# Altium schematic sheet USB3.SchDoc (part 1 of 2)
size A3; Organization: ICNS, MARCS Institute; Address1: Werrington South Campus, Great Western Highway; Address2: Werrington, NSW, 2747; SheetNumber: 9; SheetTotal: 16
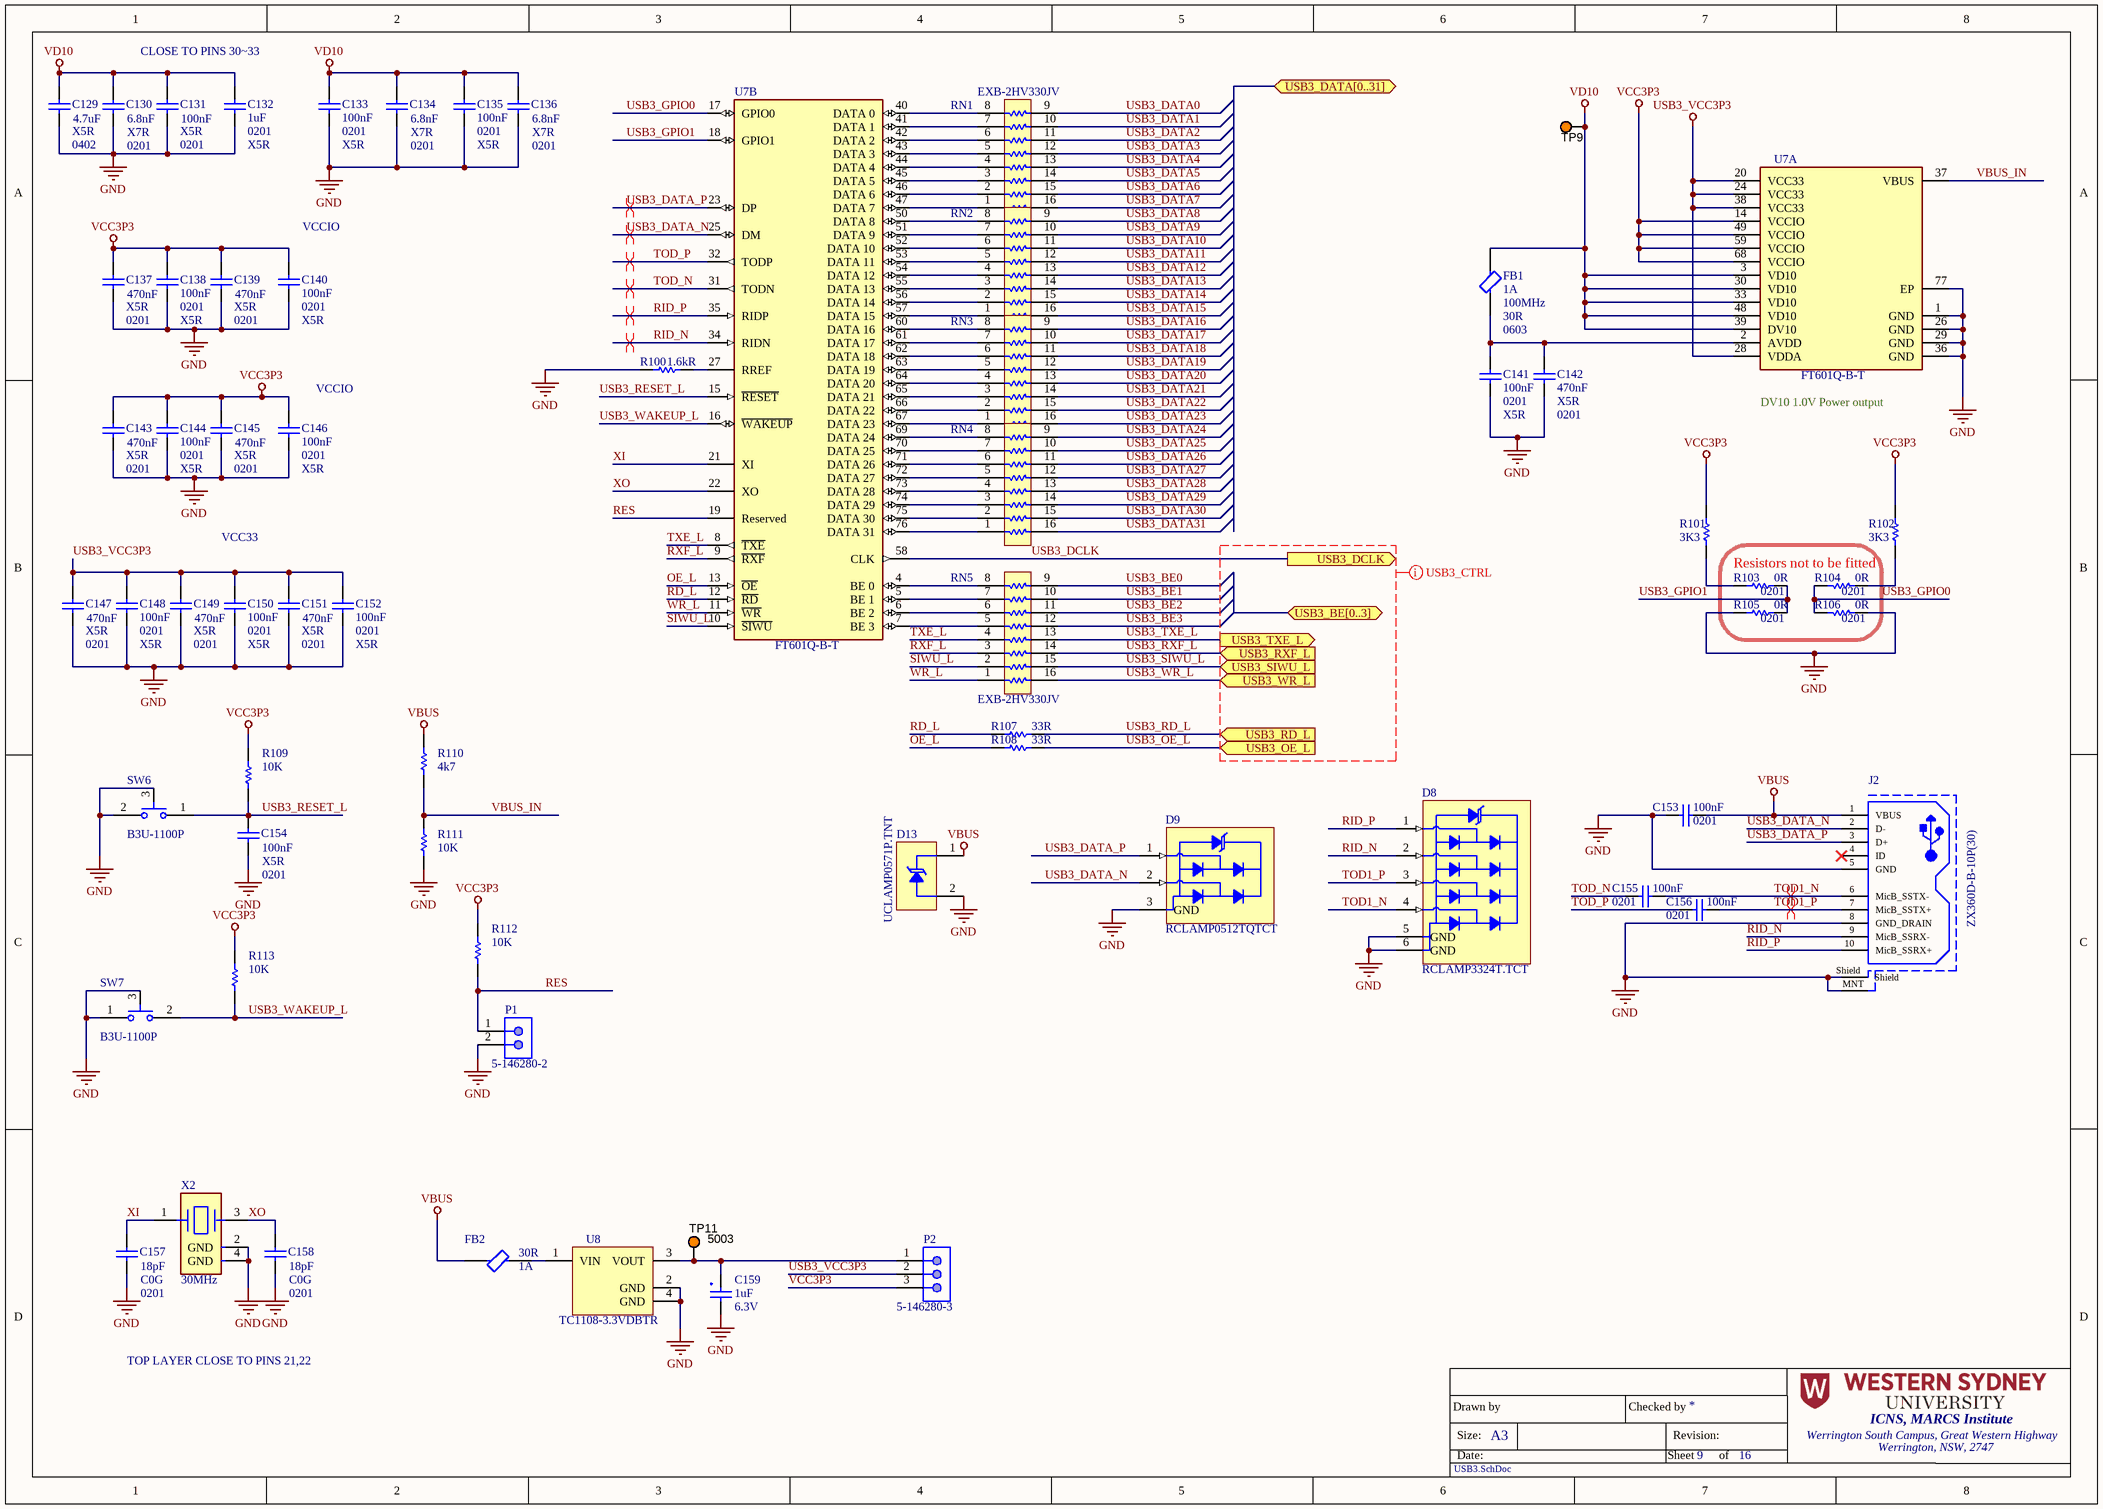
[diagram p0: USB3.SchDoc]

## Parts
C129  Capacitance: 4.7uF  Dielectric: X5R  Case Code (Imperial): 0402  [CAP 0402 (1005)]  (hidden comment: C1005X5R1A475K050BC)
C130  Dielectric: X7R  Capacitance: 6.8nF  Case Code (Imperial): 0201  [CAP 0201 (0603)]  (hidden comment: GRM033R71A682KA01D)
C131  Capacitance: 100nF  Dielectric: X5R  Case Code (Imperial): 0201  [CAP 0201 (0603)]  (hidden comment: CL03A104KP3NNNC)
C132  Capacitance: 1uF  Case Code (Imperial): 0201  Dielectric: X5R  [CAP 0201 (0603)]  (hidden comment: CL03A105KP3NSNC)
C133  Capacitance: 100nF  Case Code (Imperial): 0201  Dielectric: X5R  [CAP 0201 (0603)]  (hidden comment: CL03A104KP3NNNC)
C134  Dielectric: X7R  Capacitance: 6.8nF  Case Code (Imperial): 0201  [CAP 0201 (0603)]  (hidden comment: GRM033R71A682KA01D)
C135  Capacitance: 100nF  Case Code (Imperial): 0201  Dielectric: X5R  [CAP 0201 (0603)]  (hidden comment: CL03A104KP3NNNC)
C136  Dielectric: X7R  Capacitance: 6.8nF  Case Code (Imperial): 0201  [CAP 0201 (0603)]  (hidden comment: GRM033R71A682KA01D)
C137  Capacitance: 470nF  Dielectric: X5R  Case Code (Imperial): 0201  [CAP 0201 (0603)]  (hidden comment: LMK063BBJ474KPLF)
C138  Capacitance: 100nF  Case Code (Imperial): 0201  Dielectric: X5R  [CAP 0201 (0603)]  (hidden comment: CL03A104KP3NNNC)
C139  Capacitance: 470nF  Dielectric: X5R  Case Code (Imperial): 0201  [CAP 0201 (0603)]  (hidden comment: LMK063BBJ474KPLF)
C140  Capacitance: 100nF  Case Code (Imperial): 0201  Dielectric: X5R  [CAP 0201 (0603)]  (hidden comment: CL03A104KP3NNNC)
C141  Capacitance: 100nF  Case Code (Imperial): 0201  Dielectric: X5R  [CAP 0201 (0603)]  (hidden comment: CL03A104KP3NNNC)
C142  Capacitance: 470nF  Dielectric: X5R  Case Code (Imperial): 0201  [CAP 0201 (0603)]  (hidden comment: LMK063BBJ474KPLF)
C143  Capacitance: 470nF  Dielectric: X5R  Case Code (Imperial): 0201  [CAP 0201 (0603)]  (hidden comment: LMK063BBJ474KPLF)
C144  Capacitance: 100nF  Case Code (Imperial): 0201  Dielectric: X5R  [CAP 0201 (0603)]  (hidden comment: CL03A104KP3NNNC)
C145  Capacitance: 470nF  Dielectric: X5R  Case Code (Imperial): 0201  [CAP 0201 (0603)]  (hidden comment: LMK063BBJ474KPLF)
C146  Capacitance: 100nF  Case Code (Imperial): 0201  Dielectric: X5R  [CAP 0201 (0603)]  (hidden comment: CL03A104KP3NNNC)
C147  Capacitance: 470nF  Dielectric: X5R  Case Code (Imperial): 0201  [CAP 0201 (0603)]  (hidden comment: LMK063BBJ474KPLF)
C148  Capacitance: 100nF  Case Code (Imperial): 0201  Dielectric: X5R  [CAP 0201 (0603)]  (hidden comment: CL03A104KP3NNNC)
C149  Capacitance: 470nF  Dielectric: X5R  Case Code (Imperial): 0201  [CAP 0201 (0603)]  (hidden comment: LMK063BBJ474KPLF)
C150  Capacitance: 100nF  Case Code (Imperial): 0201  Dielectric: X5R  [CAP 0201 (0603)]  (hidden comment: CL03A104KP3NNNC)
C151  Capacitance: 470nF  Dielectric: X5R  Case Code (Imperial): 0201  [CAP 0201 (0603)]  (hidden comment: LMK063BBJ474KPLF)
C152  Capacitance: 100nF  Case Code (Imperial): 0201  Dielectric: X5R  [CAP 0201 (0603)]  (hidden comment: CL03A104KP3NNNC)
C153  Capacitance: 100nF  Case Code (Imperial): 0201  [CAP 0201 (0603)]  (hidden comment: CL03A104KP3NNNC)
C154  Capacitance: 100nF  Case Code (Imperial): 0201  Dielectric: X5R  [CAP 0201 (0603)]  (hidden comment: CL03A104KP3NNNC)
C155  Capacitance: 100nF  Case Code (Imperial): 0201  [CAP 0201 (0603)]  (hidden comment: CL03A104KP3NNNC)
C156  Capacitance: 100nF  Case Code (Imperial): 0201  [CAP 0201 (0603)]  (hidden comment: CL03A104KP3NNNC)
C157  value 18pF  Dielectric: C0G  Case/Package: 0201  [CAP 0201 (0603)]  (hidden comment: C0201C180K3GACTU)
C158  value 18pF  Dielectric: C0G  Case/Package: 0201  [CAP 0201 (0603)]  (hidden comment: C0201C180K3GACTU)
C159  Capacitance: 1uF  Voltage Rating: 6.3V  [DFN80P110X55-2N]  (hidden comment: F380J105MUA)
D8  RCLAMP3324T.TCT  [DIO_RCLAMP3324T.TCT]
D9  RCLAMP0512TQTCT  [DIO_RCLAMP0512TQTCT]
D13  UCLAMP0571P.TNT  [uCLAMP0571P]
FB1  Max Current Rating: 1A  Test Frequency: 100MHz  Impedance: 30R  Case Code (Imperial): 0603  [FP-BLM18-0_15-t0_8-IPC_A]  (hidden comment: BLM18PG300SH1D)
FB2  Max Current Rating: 1A  Impedance: 30R  [FP-BLM18-0_15-t0_8-IPC_A]  (hidden comment: BLM18PG300SH1D)
J2  ZX360D-B-10P(30)  [FP-ZX360D-B-10P-MFG]
P1  5-146280-2  [TECO-5-146280-2_V]
P2  5-146280-3  [TECO-5-146280-3_V]
R100  Resistance: 1.6kR  [RES 0201 (0603)]  (hidden comment: ERJ-1GNF1601C)
R101  value 3K3  [RES 0201 (0603)]  (hidden comment: RC0201FR-073K3L)
R102  value 3K3  [RES 0201 (0603)]  (hidden comment: RC0201FR-073K3L)
R103  value 0R  Case Code (Imperial): 0201  [RES 0201 (0603)]  (hidden comment: AF0201JR-070RL)
R104  value 0R  Case Code (Imperial): 0201  [RES 0201 (0603)]  (hidden comment: AF0201JR-070RL)
R105  value 0R  Case Code (Imperial): 0201  [RES 0201 (0603)]  (hidden comment: AF0201JR-070RL)
R106  value 0R  Case Code (Imperial): 0201  [RES 0201 (0603)]  (hidden comment: AF0201JR-070RL)
R107  value 33R  [RES 0402 (1005)]  (hidden comment: CRGCQ0402J33R)
R108  value 33R  [RES 0402 (1005)]  (hidden comment: CRGCQ0402J33R)
R109  value 10K  [RES 0201 (0603)]  (hidden comment: AC0201FR-0710KL)
R110  value 4k7  [RES 0201 (0603)]  (hidden comment: AC0201FR-074K7L)
R111  value 10K  [RES 0201 (0603)]  (hidden comment: AC0201FR-0710KL)
R112  value 10K  [RES 0201 (0603)]  (hidden comment: AC0201FR-0710KL)
R113  value 10K  [RES 0201 (0603)]  (hidden comment: AC0201FR-0710KL)
RN1  EXB-2HV330JV  [PNSC-EXB-2HV330JV-8_N]
RN2  EXB-2HV330JV  [PNSC-EXB-2HV330JV-8_N]  (value not drawn)
RN3  EXB-2HV330JV  [PNSC-EXB-2HV330JV-8_N]  (value not drawn)
RN4  EXB-2HV330JV  [PNSC-EXB-2HV330JV-8_N]  (value not drawn)
RN5  EXB-2HV330JV  [PNSC-EXB-2HV330JV-8_N]
SW6  B3U-1100P  [FP-B3U-1100P-MFG]
SW7  B3U-1100P  [FP-B3U-1100P-MFG]
TP9  5003  [KSTN-5003]  (value not drawn)
TP11  5003  [KSTN-5003]
U7  FT601Q-B-T  [FP-QFN-76-IPC_A]  (parts A,B of 2)
U8  TC1108-3.3VDBTR  [SOT-223-DB3_L]
X2  Frequency: 30MHz  [FP-ABM8-MFG]  (hidden comment: ABM8-30.000MHZ-10-1-U-T)

## Blocks framed on the sheet
Resistors not to be fitted: R103-R106

## Ports
USB3_BE[0..3] (bidir), USB3_DATA[0..31] (bidir), USB3_DCLK (out), USB3_OE_L (in), USB3_RD_L (in), USB3_RXF_L (in), USB3_SIWU_L (in), USB3_TXE_L (out), USB3_WR_L (in)

## Nets
GND: C129.2 C130.2 C131.2 C132.1 C133.2 C134.2 C135.2 C136.2 C137.2 C138.2 C139.2 C140.2 C141.2 C142.2 C143.2 C144.2 C145.2 C146.2 C147.2 C148.2 C149.2 C150.2 C151.2 C152.2 C153.1 C154.2 C157.2 C158.2 C159.2 D8.5(GND) D8.6(GND) D9.3(GND) D13.2(In_2) J2.5(GND) J2.8(GND_DRAIN) J2.MNT J2.Shield P1.2 R100.1 R105.1 R106.1 R111.1 SW6.2 SW6.3 SW7.1 SW7.3 U7.1(GND) U7.26(GND) U7.29(GND) U7.36(GND) U7.77(EP) U8.2(GND) U8.4(GND) X2.2(GND) X2.4(GND)
USB3_VCC3P3: C147.1 C148.1 C149.1 C150.1 C151.1 C152.1 P2.2 U7.20(VCC33) U7.24(VCC33) U7.28(VDDA) U7.38(VCC33)
VBUS: C153.2 D13.1(In_1) FB2.1 J2.1(VBUS) R110.2
VCC3P3: C137.1 C138.1 C139.1 C140.1 C143.1 C144.1 C145.1 C146.1 P2.3 R101.2 R102.2 R109.2 R112.2 R113.2 U7.14(VCCIO) U7.49(VCCIO) U7.59(VCCIO) U7.68(VCCIO)
VD10: C129.1 C130.1 C131.1 C132.2 C133.1 C134.1 C135.1 C136.1 FB1.2 TP9.1 U7.3(VD10) U7.30(VD10) U7.33(VD10) U7.39(DV10) U7.48(VD10)
OE_L: R108.1 U7.13(~{OE})
RD_L: R107.1 U7.12(~{RD})
RES: P1.1 R112.1 U7.19(Reserved)
RID_N: D8.2(In_2) J2.9(MicB_SSRX-) U7.34(RIDN)
RID_P: D8.1(In_1) J2.10(MicB_SSRX+) U7.35(RIDP)
RXF_L: RN5.3 U7.9(~{RXF})
SIWU_L: RN5.2 U7.10(~{SIWU})
TOD1_N: C155.2 D8.4(In_4) J2.6(MicB_SSTX-)
TOD1_P: C156.2 D8.3(In_3) J2.7(MicB_SSTX+)
TOD_N: C155.1 U7.31(TODN)
TOD_P: C156.1 U7.32(TODP)
TXE_L: RN5.4 U7.8(~{TXE})
USB3_BE0: RN5.9
USB3_BE1: RN5.10
USB3_BE2: RN5.11
USB3_BE3: RN5.12
USB3_DATA0: RN1.9
USB3_DATA1: RN1.10
USB3_DATA2: RN1.11
USB3_DATA3: RN1.12
USB3_DATA4: RN1.13
USB3_DATA5: RN1.14
USB3_DATA6: RN1.15
USB3_DATA7: RN1.16
USB3_DATA8: RN2.9
USB3_DATA9: RN2.10
USB3_DATA10: RN2.11
USB3_DATA11: RN2.12
USB3_DATA12: RN2.13
USB3_DATA13: RN2.14
USB3_DATA14: RN2.15
USB3_DATA15: RN2.16
USB3_DATA16: RN3.9
USB3_DATA17: RN3.10
USB3_DATA18: RN3.11
USB3_DATA19: RN3.12
USB3_DATA20: RN3.13
USB3_DATA21: RN3.14
USB3_DATA22: RN3.15
USB3_DATA23: RN3.16
USB3_DATA24: RN4.9
USB3_DATA25: RN4.10
USB3_DATA26: RN4.11
USB3_DATA27: RN4.12
USB3_DATA28: RN4.13
USB3_DATA29: RN4.14
USB3_DATA30: RN4.15
USB3_DATA31: RN4.16
USB3_DATA_N: D9.2(In_2) J2.2(D-) U7.25(DM)
USB3_DATA_P: D9.1(In_1) J2.3(D+) U7.23(DP)
USB3_DCLK: U7.58(CLK) ; port USB3_DCLK
USB3_GPIO0: R104.2 R106.2 U7.17(GPIO0)
USB3_GPIO1: R103.2 R105.2 U7.18(GPIO1)
USB3_OE_L: R108.2 ; port USB3_OE_L
USB3_RD_L: R107.2 ; port USB3_RD_L
USB3_RESET_L: C154.1 R109.1 SW6.1 U7.15(~{RESET})
USB3_RXF_L: RN5.14 ; port USB3_RXF_L
USB3_SIWU_L: RN5.15 ; port USB3_SIWU_L
USB3_TXE_L: RN5.13 ; port USB3_TXE_L
USB3_WAKEUP_L: R113.1 SW7.2 U7.16(~{WAKEUP})
USB3_WR_L: RN5.16 ; port USB3_WR_L
VBUS_IN: R110.1 R111.2 U7.37(VBUS)
WR_L: RN5.1 U7.11(~{WR})
XI: C157.1 U7.21(XI) X2.1
XO: C158.1 U7.22(XO) X2.3
NetC141_1: C141.1 C142.1 FB1.1 U7.2(AVDD)
NetC159_1: C159.1 P2.1 TP11.1 U8.3(VOUT)
NetFB2_2: FB2.2 U8.1(VIN)
NetR100_2: R100.2 U7.27(RREF)
NetR101_1: R101.1 R103.1
NetR102_1: R102.1 R104.1
NetRN1_1: RN1.1 U7.47(DATA_7)
NetRN1_2: RN1.2 U7.46(DATA_6)
NetRN1_3: RN1.3 U7.45(DATA_5)
NetRN1_4: RN1.4 U7.44(DATA_4)
NetRN1_5: RN1.5 U7.43(DATA_3)
NetRN1_6: RN1.6 U7.42(DATA_2)
NetRN1_7: RN1.7 U7.41(DATA_1)
NetRN1_8: RN1.8 U7.40(DATA_0)
NetRN2_1: RN2.1 U7.57(DATA_15)
NetRN2_2: RN2.2 U7.56(DATA_14)
NetRN2_3: RN2.3 U7.55(DATA_13)
NetRN2_4: RN2.4 U7.54(DATA_12)
NetRN2_5: RN2.5 U7.53(DATA_11)
NetRN2_6: RN2.6 U7.52(DATA_10)
NetRN2_7: RN2.7 U7.51(DATA_9)
NetRN2_8: RN2.8 U7.50(DATA_8)
NetRN3_1: RN3.1 U7.67(DATA_23)
NetRN3_2: RN3.2 U7.66(DATA_22)
NetRN3_3: RN3.3 U7.65(DATA_21)
NetRN3_4: RN3.4 U7.64(DATA_20)
NetRN3_5: RN3.5 U7.63(DATA_19)
NetRN3_6: RN3.6 U7.62(DATA_18)
NetRN3_7: RN3.7 U7.61(DATA_17)
NetRN3_8: RN3.8 U7.60(DATA_16)
NetRN4_1: RN4.1 U7.76(DATA_31)
NetRN4_2: RN4.2 U7.75(DATA_30)
NetRN4_3: RN4.3 U7.74(DATA_29)
NetRN4_4: RN4.4 U7.73(DATA_28)
NetRN4_5: RN4.5 U7.72(DATA_27)
NetRN4_6: RN4.6 U7.71(DATA_26)
NetRN4_7: RN4.7 U7.70(DATA_25)
NetRN4_8: RN4.8 U7.69(DATA_24)
NetRN5_5: RN5.5 U7.7(BE_3)
NetRN5_6: RN5.6 U7.6(BE_2)
NetRN5_7: RN5.7 U7.5(BE_1)
NetRN5_8: RN5.8 U7.4(BE_0)

Not connected (* = marked no-connect by the designer): J2 4(ID)*

## Layout directives
differential pair; differential pair class USB3_DATA; net class DIGITAL: USB3_DATA_N, USB3_DATA_P
differential pair; differential pair class USB3_RID; net class DIGITAL: RID_N, RID_P
differential pair; differential pair class USB3_TOD; net class DIGITAL: TOD_N, TOD_P
differential pair; differential pair class USB3_TOD1; net class DIGITAL: TOD1_N, TOD1_P
net class USB3_CTRL: (no net found under the mark)

## Notes on the sheet
- CLOSE TO PINS 30~33
- (near C140) VCCIO
- (near C146) VCCIO
- (near U7) DV10 1.0V Power output
- VCC33
- TOP LAYER CLOSE TO PINS 21,22
- Drawn by
- Size:
- Date:
- A3
- Checked by
- Sheet
- Revision:
- of